# EAGLE design capstone electrical circuit rev2 (EAGLE 9.6.2)
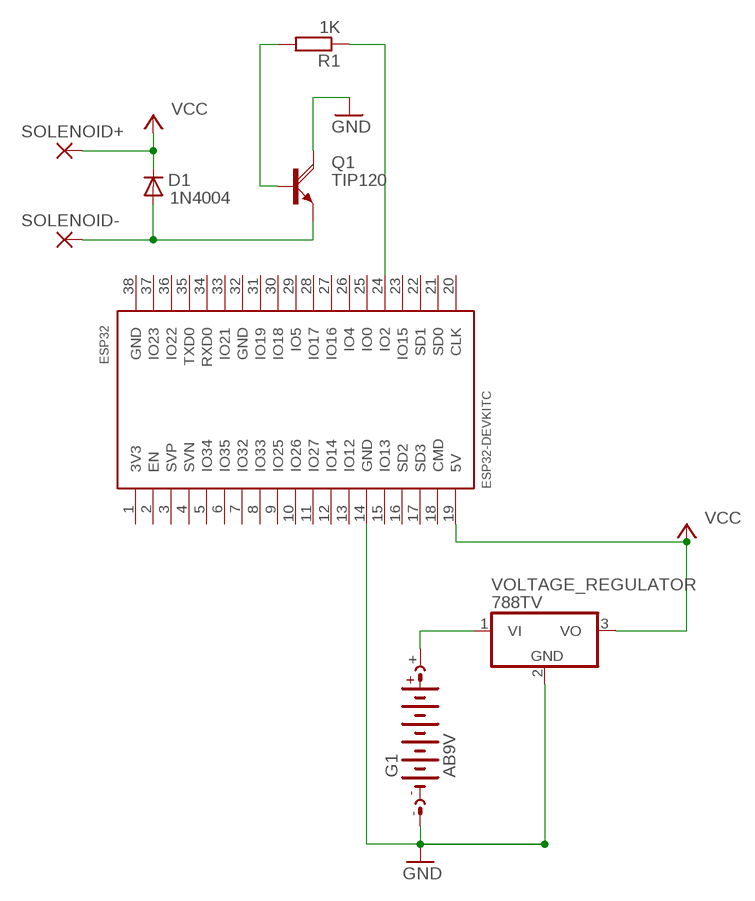
[diagram p0: schematic, sheet 1]

## Parts
D1  1N4004  [DO41-10]
ESP32  ESP32DEVKITC  [ESP32-DEVKITC]
G1  AB9V  [AB9V]
Q1  TIP120  [TO220AH]
R1  1K  R-EU_0207/10  [0207/10]
SOLENOID+  WIREPAD2,54/1,0  [2,54/1,0]
SOLENOID-  WIREPAD2,54/1,0  [2,54/1,0]
VOLTAGE_REGULATOR  788TV  [TO220V]

## Nets
GND: ESP32.14(GND) G1.- Q1.C VOLTAGE_REGULATOR.2(GND)
N$3: D1.A Q1.E SOLENOID-.1(P)
N$4: G1.+ VOLTAGE_REGULATOR.1(VI)
N$5: Q1.B R1.2
N$6: ESP32.24(IO2) R1.1
VCC: D1.C ESP32.19(5V) SOLENOID+.1(P) VOLTAGE_REGULATOR.3(VO)
Unconnected: ESP32.1(3V3) ESP32.2(EN) ESP32.3(SVP) ESP32.4(SVN) ESP32.5(IO34) ESP32.6(IO35) ESP32.7(IO32) ESP32.8(IO33) ESP32.9(IO25) ESP32.10(IO26) ESP32.11(IO27) ESP32.12(IO14) ESP32.13(IO12) ESP32.15(IO13) ESP32.16(SD2) ESP32.17(SD3) ESP32.18(CMD) ESP32.20(CLK) ESP32.21(SD0) ESP32.22(SD1) ESP32.23(IO15) ESP32.25(IO0) ESP32.26(IO4) ESP32.27(IO16) ESP32.28(IO17) ESP32.29(IO5) ESP32.30(IO18) ESP32.31(IO19) ESP32.32(GND) ESP32.33(IO21) ESP32.34(RXD0) ESP32.35(TXD0) ESP32.36(IO22) ESP32.37(IO23) ESP32.38(GND)

## Library data of the parts
D1 = adafruit:1N4004: DIODE General purpose 1N400x type rectifier (With bigger pads) http://www.ladyada.net/library/pcb/eaglelibrary.html
ESP32 = ESP32-DEVKITC:ESP32DEVKITC
G1 = battery:AB9V: 9-V BATTERY CLIP
Q1 = transistor-power:TIP120: NPN DARLINGTON TRANSISTOR
R1 = rcl:R-EU_: RESISTOR, European symbol; SPICEPREFIX: R
SOLENOID+ SOLENOID- = wirepad:WIREPAD: Wire PAD connect wire on PCB
VOLTAGE_REGULATOR = linear:78*: Positive VOLTAGE REGULATOR Source: http://cache.national.com/ds/LM/LM78L05.pdf http://www.fairchildsemi.com/ds/LM/LM7805.pdf

## Board
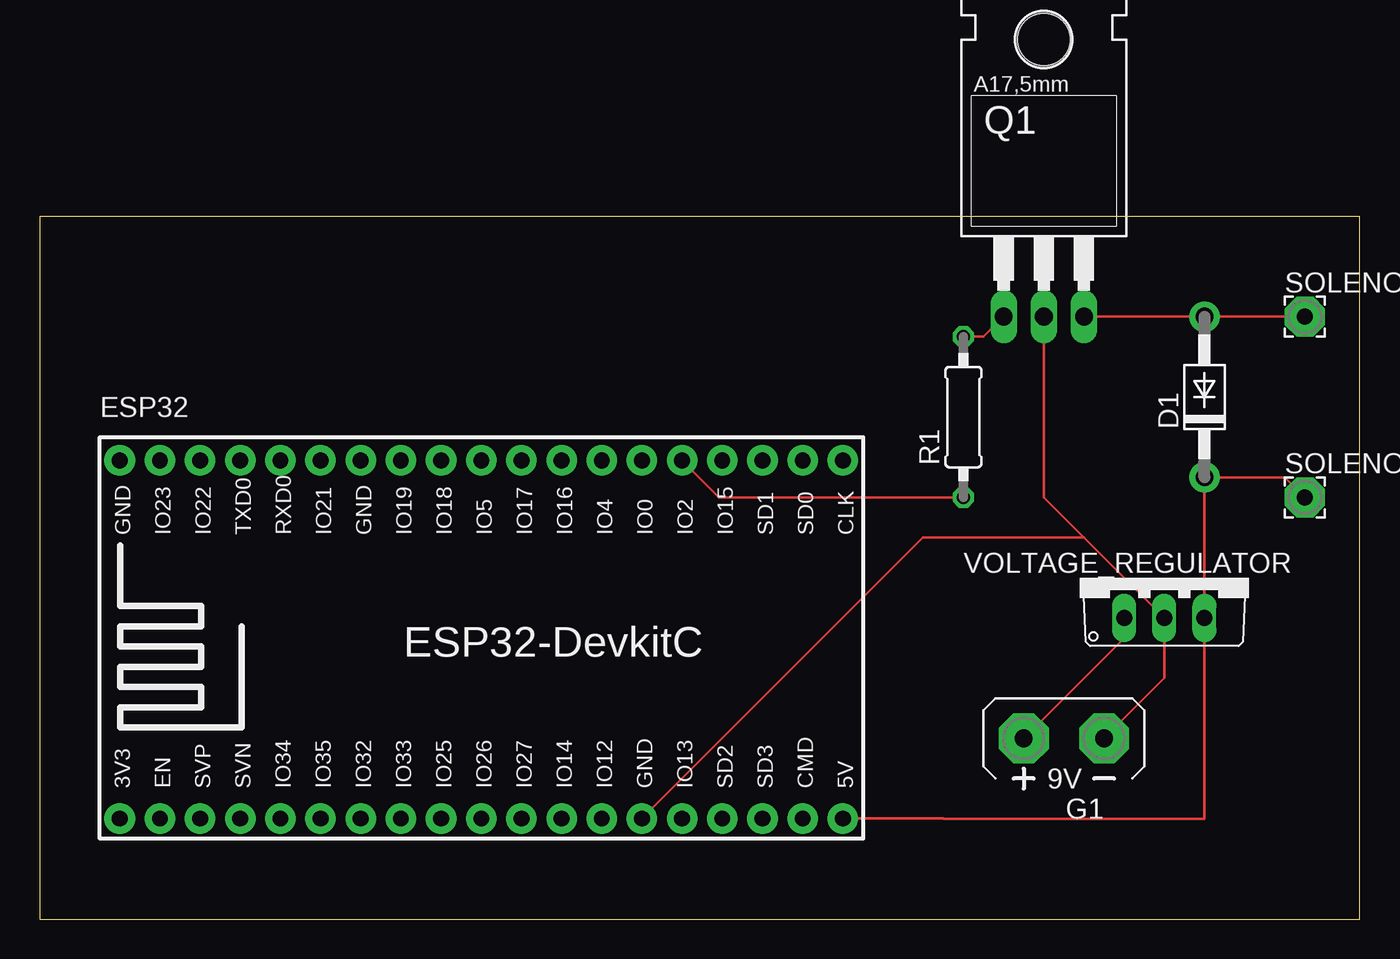
[diagram p1: board, top side]

Size 83.49 x 44.44 mm. Coordinates in mm from the lower left corner, seen from the top.
Outline: 0,0 83.49,0 83.49,44.44 0,44.44 0,0
Copper layers (1*16): Top 0.035mm / dielectric 1.5mm / Bottom 0.035mm
Design rules "default": minimum track width 6mil, minimum drill 0.35mm, track to track 6mil, track to pad 6mil, pad to pad 6mil, via to via 6mil, smd to smd 6mil, copper to edge 40mil, drill to drill 6mil, minimum pad ring 10mil, minimum via ring 8mil, stop-mask expansion 4mil, vias tented up to drill 0mil, thermal gap 10mil

### Footprints (pad centres in the part's own frame; a part is rotated, then mirrored left to right if it is on the bottom)
DO41-10 = drill 1.118 pad 1.93: A 5.08,0; C -5.08,0
ESP32-DEVKITC = drill 1 pad 1.93: 1 -22.87,-11.42; 2 -20.33,-11.42; 3 -17.79,-11.42; 4 -15.25,-11.42; 5 -12.71,-11.42; 6 -10.17,-11.42; 7 -7.63,-11.42; 8 -5.09,-11.42; 9 -2.55,-11.42; 10 -0.01,-11.42; 11 2.53,-11.42; 12 5.07,-11.42; 13 7.61,-11.42; 14 10.15,-11.42; 15 12.69,-11.42; 16 15.23,-11.42; 17 17.77,-11.42; 18 20.31,-11.42; 19 22.85,-11.42; 20 22.85,11.23; 21 20.31,11.23; 22 17.77,11.23; 23 15.23,11.23; 24 12.69,11.23; 25 10.15,11.23; 26 7.61,11.23; 27 5.07,11.23; 28 2.53,11.23; 29 -0.01,11.23; 30 -2.55,11.23; 31 -5.09,11.23; 32 -7.63,11.23; 33 -10.17,11.23; 34 -12.71,11.23; 35 -15.25,11.23; 36 -17.79,11.23; 37 -20.33,11.23; 38 -22.87,11.23
AB9V = drill 1.118 pad 3.15 octagon: + 0,2.54; - 0,-2.54
TO220AH = drill 1.118 long: B -2.54,-6.35; C 0,-6.35; E 2.54,-6.35 | hole 3.302: 0,11.176
0207/10 = drill 0.813 octagon: 1 -5.08,0; 2 5.08,0
2,54/1,0 = drill 1.016 pad 2.54 octagon: 1 0,0
TO220V = drill 1.016 long: 1 -2.54,-2.54; 2 0,-2.54; 3 2.54,-2.54

### Placement (x,y rotation side)
D1  73.66,33.02 90 top
ESP32  27.94,17.78 0 top
G1  64.77,11.43 90 top
Q1  63.5,44.45 0 top
R1  58.42,31.75 90 top
SOLENOID+  80.01,26.67 0 top
SOLENOID-  80.01,38.1 0 top
VOLTAGE_REGULATOR  71.12,21.59 0 top

### Tracks (layer width: path | path; a pad name or v marks a point on that pad's centre or on a via)
GND
  Top 0.152: G1.- 71.12,15.24 VOLTAGE_REGULATOR.2 63.5,26.67 Q1.C | ESP32.14 55.86,24.13 66.04,24.13
N$3
  Top 0.152: SOLENOID-.1 D1.A Q1.E
N$4
  Top 0.152: VOLTAGE_REGULATOR.1 68.58,17.78 G1.+
N$5
  Top 0.152: Q1.B 59.69,36.83 R1.2
N$6
  Top 0.152: R1.1 42.97,26.67 ESP32.24
VCC
  Top 0.152: SOLENOID+.1 78.74,27.94 D1.C VOLTAGE_REGULATOR.3 73.66,6.35 57.15,6.35 57.14,6.36 ESP32.19